# EAGLE schematic esp32-template (EAGLE 6.6.0)
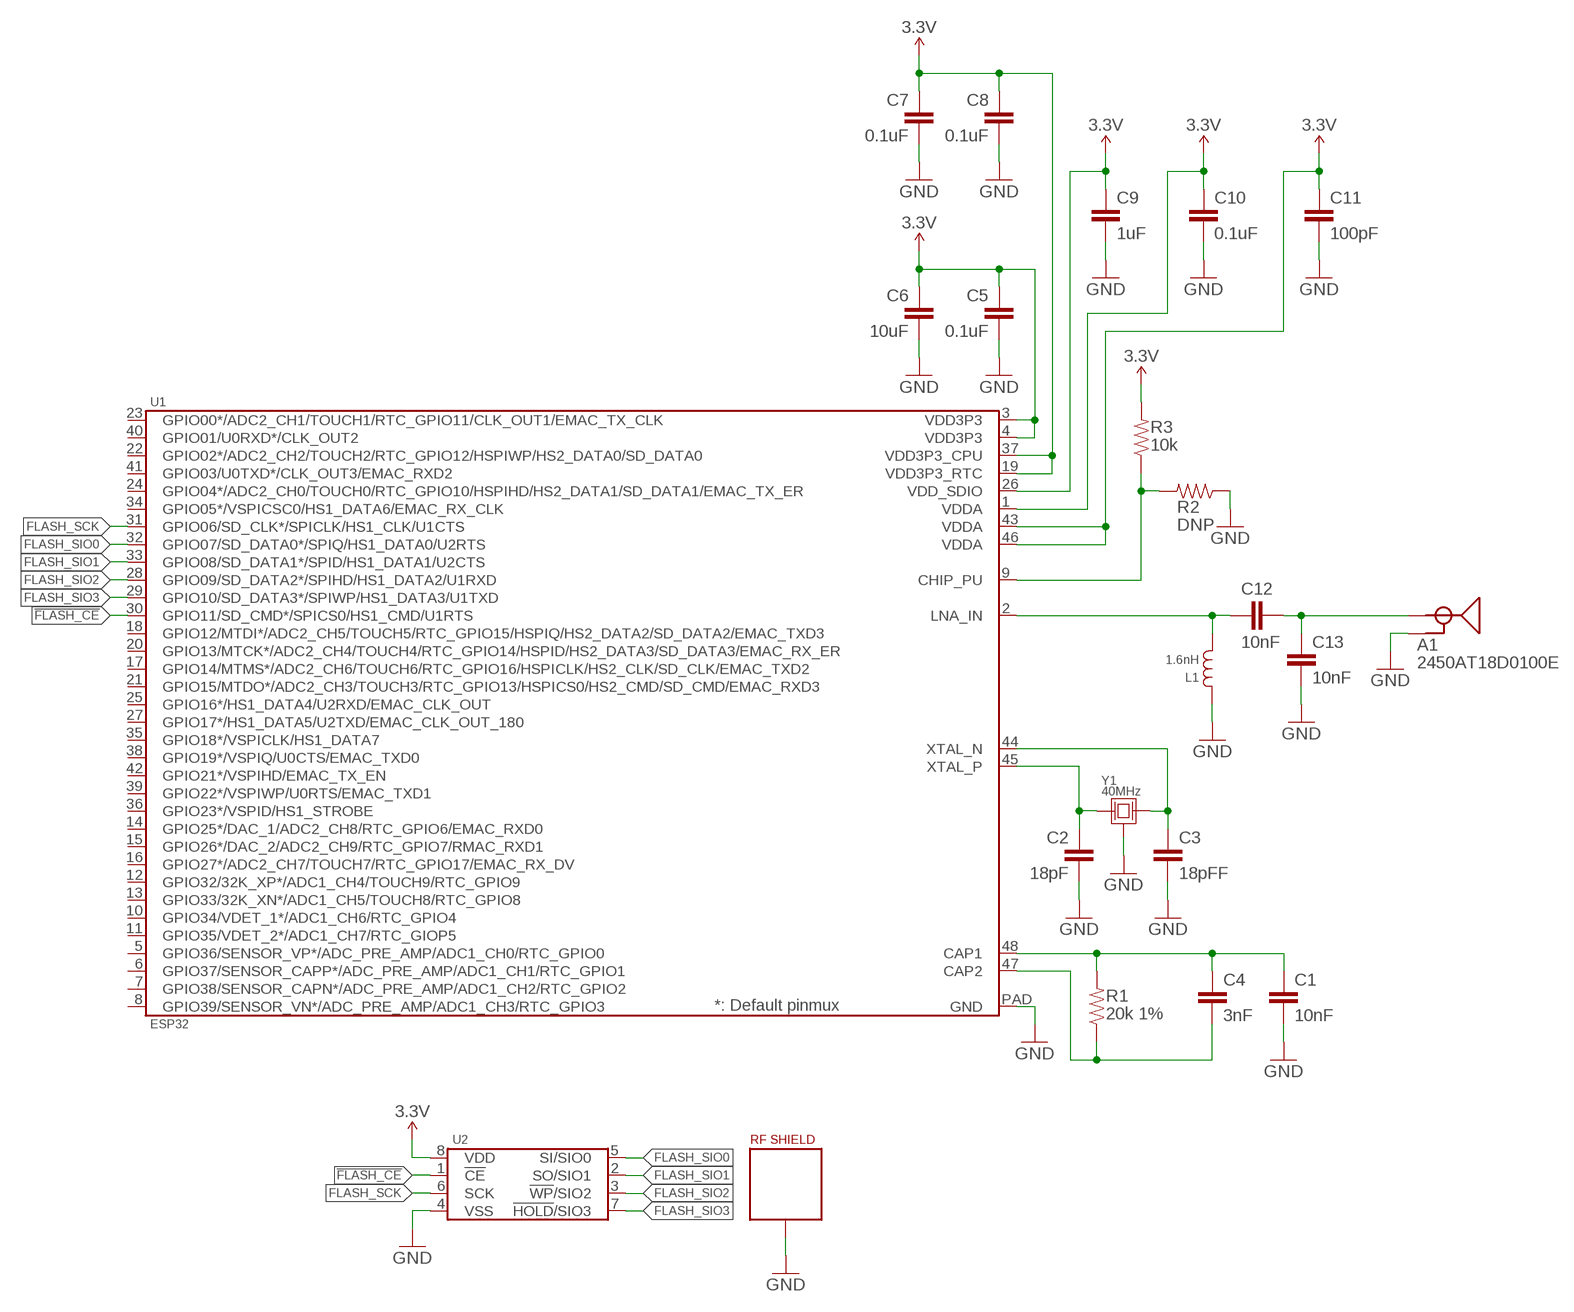
[diagram p0: schematic, sheet 1]

## Parts
A1  2450AT18D0100E  [4SMD-ANTENNA]
C1  10nF  CAP-0603  [0603-CAP]
C2  18pF  CAP-0603  [0603-CAP]
C3  18pFF  CAP-0603  [0603-CAP]
C4  3nF  CAP-0603  [0603-CAP]
C5  0.1uF  CAP-0603  [0603-CAP]
C6  10uF  CAP-0603  [0603-CAP]
C7  0.1uF  CAP-0603  [0603-CAP]
C8  0.1uF  CAP-0603  [0603-CAP]
C9  1uF  CAP-0603  [0603-CAP]
C10  0.1uF  CAP-0603  [0603-CAP]
C11  100pF  CAP-0603  [0603-CAP]
C12  10nF  CAP-0603  [0603-CAP]
C13  10nF  CAP-0603  [0603-CAP]
L1  1.6nH  INDUCTOR-0603  [0603-FERRITE]
R1  20k 1%  RESISTOR-0603  [0603-CAP]
R2  DNP  RESISTOR-0603  [0603-CAP]
R3  10k  RESISTOR-0603  [0603-CAP]
U1  ESP32  [ESP32]
U2  FLASH-USON  [USON-8-2X3]
U$1  RF-SHIELD  [RF_SHIELD-.65X.65]
Y1  40MHz  CRYSTAL-3.2X2.5  [FA-238]

## Nets
3.3V: C5.1 C6.1 C7.1 C8.1 C9.1 C10.1 C11.1 R3.2 U1.1(VDDA) U1.3(VDD3P3) U1.4(VDD3P3) U1.19(VDD3P3_RTC) U1.26(VDD_SDIO) U1.37(VDD3P3_CPU) U1.43(VDDA) U1.46(VDDA) U2.8(VDD)
!FLASH_CE: U1.30(GPIO11/SD_CMD*/SPICS0/HS1_CMD/U1RTS) U2.1(!CE)
FLASH_SCK: U1.31(GPIO06/SD_CLK*/SPICLK/HS1_CLK/U1CTS) U2.6(SCK)
FLASH_SIO0: U1.32(GPIO07/SD_DATA0*/SPIQ/HS1_DATA0/U2RTS) U2.5(SI/SIO0)
FLASH_SIO1: U1.33(GPIO08/SD_DATA1*/SPID/HS1_DATA1/U2CTS) U2.2(SO/SIO1)
FLASH_SIO2: U1.28(GPIO09/SD_DATA2*/SPIHD/HS1_DATA2/U1RXD) U2.3(!WP!/SIO2)
FLASH_SIO3: U1.29(GPIO10/SD_DATA3*/SPIWP/HS1_DATA3/U1TXD) U2.7(!HOLD!/SIO3)
GND: A1.2(GND) A1.3(GND) A1.4(GND) C1.2 C2.2 C3.2 C5.2 C6.2 C7.2 C8.2 C9.2 C10.2 C11.2 C13.2 L1.P$1 R2.1 U1.PAD(GND) U2.4(VSS) U$1.P$1 U$1.P$2 U$1.P$3 U$1.P$4 U$1.P$5 U$1.P$6 U$1.P$7 U$1.P$8 U$1.P$9 U$1.P$10 U$1.P$11 U$1.P$12 Y1.2(GND) Y1.4(GND)
N$1: C1.1 C4.1 R1.2 U1.48(CAP1)
N$2: C4.2 R1.1 U1.47(CAP2)
N$3: C3.1 U1.44(XTAL_N) Y1.3
N$4: C2.1 U1.45(XTAL_P) Y1.1
N$5: A1.1(SIGNAL) C12.2 C13.1
N$6: C12.1 L1.P$2 U1.2(LNA_IN)
N$7: R2.2 R3.1 U1.9(CHIP_PU)
Unconnected: U1.5(GPIO36/SENSOR_VP*/ADC_PRE_AMP/ADC1_CH0/RTC_GPIO0) U1.6(GPIO37/SENSOR_CAPP*/ADC_PRE_AMP/ADC1_CH1/RTC_GPIO1) U1.7(GPIO38/SENSOR_CAPN*/ADC_PRE_AMP/ADC1_CH2/RTC_GPIO2) U1.8(GPIO39/SENSOR_VN*/ADC_PRE_AMP/ADC1_CH3/RTC_GPIO3) U1.10(GPIO34/VDET_1*/ADC1_CH6/RTC_GPIO4) U1.11(GPIO35/VDET_2*/ADC1_CH7/RTC_GIOP5) U1.12(GPIO32/32K_XP*/ADC1_CH4/TOUCH9/RTC_GPIO9) U1.13(GPIO33/32K_XN*/ADC1_CH5/TOUCH8/RTC_GPIO8) U1.14(GPIO25*/DAC_1/ADC2_CH8/RTC_GPIO6/EMAC_RXD0) U1.15(GPIO26*/DAC_2/ADC2_CH9/RTC_GPIO7/RMAC_RXD1) U1.16(GPIO27*/ADC2_CH7/TOUCH7/RTC_GPIO17/EMAC_RX_DV) U1.17(GPIO14/MTMS*/ADC2_CH6/TOUCH6/RTC_GPIO16/HSPICLK/HS2_CLK/SD_CLK/EMAC_TXD2) U1.18(GPIO12/MTDI*/ADC2_CH5/TOUCH5/RTC_GPIO15/HSPIQ/HS2_DATA2/SD_DATA2/EMAC_TXD3) U1.20(GPIO13/MTCK*/ADC2_CH4/TOUCH4/RTC_GPIO14/HSPID/HS2_DATA3/SD_DATA3/EMAC_RX_ER) U1.21(GPIO15/MTDO*/ADC2_CH3/TOUCH3/RTC_GPIO13/HSPICS0/HS2_CMD/SD_CMD/EMAC_RXD3) U1.22(GPIO02*/ADC2_CH2/TOUCH2/RTC_GPIO12/HSPIWP/HS2_DATA0/SD_DATA0) U1.23(GPIO00*/ADC2_CH1/TOUCH1/RTC_GPIO11/CLK_OUT1/EMAC_TX_CLK) U1.24(GPIO04*/ADC2_CH0/TOUCH0/RTC_GPIO10/HSPIHD/HS2_DATA1/SD_DATA1/EMAC_TX_ER) U1.25(GPIO16*/HS1_DATA4/U2RXD/EMAC_CLK_OUT) U1.27(GPIO17*/HS1_DATA5/U2TXD/EMAC_CLK_OUT_180) U1.34(GPIO05*/VSPICSC0/HS1_DATA6/EMAC_RX_CLK) U1.35(GPIO18*/VSPICLK/HS1_DATA7) U1.36(GPIO23*/VSPID/HS1_STROBE) U1.38(GPIO19*/VSPIQ/U0CTS/EMAC_TXD0) U1.39(GPIO22*/VSPIWP/U0RTS/EMAC_TXD1) U1.40(GPIO01/U0RXD*/CLK_OUT2) U1.41(GPIO03/U0TXD*/CLK_OUT3/EMAC_RXD2) U1.42(GPIO21*/VSPIHD/EMAC_TX_EN)

## Library data of the parts
A1 = Passives:2450AT18D0100E
C1-C13 = Passives:CAP
L1 = Passives:INDUCTOR
R1-R3 = Passives:RESISTOR
U1 = Espressif:ESP32
U2 = Microchip:FLASH
U$1 = Passives:RF-SHIELD
Y1 = Passives:CRYSTAL